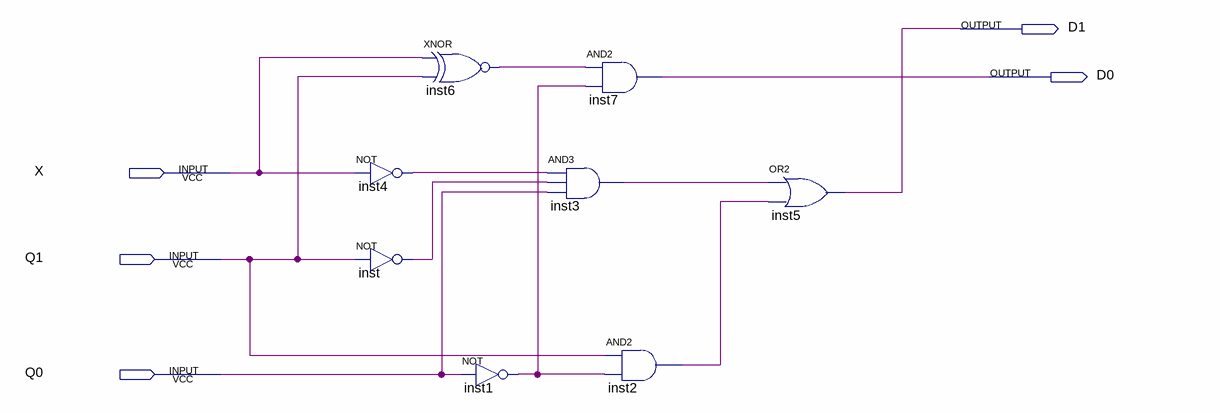
[diagram p0: schematic sheet]
// Quartus schematic lab2.bdf as structural Verilog: 8 symbols, 5 pins
module lab2 (
  input  X,
  input  Q1,
  input  Q0,
  output D1,
  output D0
);

  wire inst1_out, inst2_out, inst3_out, inst4_out, inst6_out, inst_out;

  not inst4 (inst4_out, X);
  not inst (inst_out, Q1);
  xnor inst6 (inst6_out, X, Q1);
  not inst1 (inst1_out, Q0);
  and inst7 (D0, inst6_out, inst1_out);
  and inst3 (inst3_out, inst4_out, inst_out, Q0);
  and inst2 (inst2_out, Q1, inst1_out);
  or inst5 (D1, inst3_out, inst2_out);
endmodule
